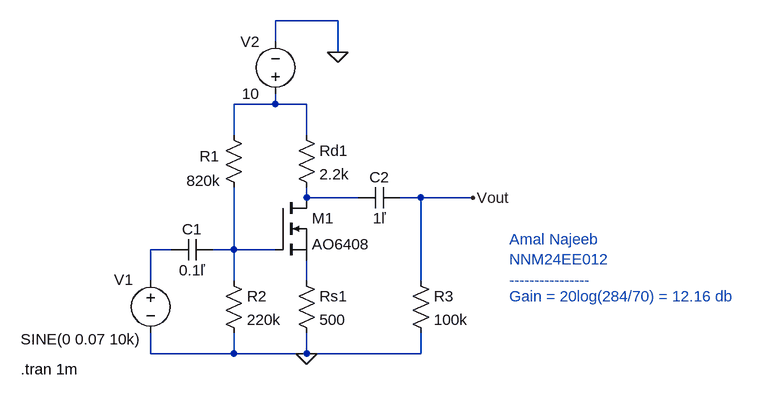
[diagram p0: schematic NNM24EE012_AmalNajeeb.asc]
NNM24EE012_AmalNajeeb.asc, the LTspice schematic file:
Version 4.1
SHEET 1 880 680
WIRE 192 -208 96 -208
WIRE 96 -176 96 -208
WIRE 192 -160 192 -208
WIRE 96 -80 96 -96
WIRE 96 -80 32 -80
WIRE 144 -80 96 -80
WIRE 32 -32 32 -80
WIRE 144 -32 144 -80
WIRE 144 64 144 48
WIRE 224 64 144 64
WIRE 320 64 288 64
WIRE 400 64 320 64
WIRE -64 144 -96 144
WIRE 32 144 32 48
WIRE 32 144 0 144
WIRE 96 144 32 144
WIRE -96 192 -96 144
WIRE 32 192 32 144
WIRE 144 192 144 160
WIRE 320 192 320 64
WIRE -96 304 -96 272
WIRE 32 304 32 272
WIRE 32 304 -96 304
WIRE 144 304 144 272
WIRE 144 304 32 304
WIRE 320 304 320 272
WIRE 320 304 144 304
FLAG 144 304 0
FLAG 192 -160 0
FLAG 400 64 Vout
SYMBOL nmos 96 64 R0
SYMATTR InstName M1
SYMATTR Value AO6408
SYMBOL res 16 -48 R0
WINDOW 0 -37 48 Left 2
WINDOW 3 -57 86 Left 2
SYMATTR InstName R1
SYMATTR Value 820k
SYMBOL res 16 176 R0
SYMATTR InstName R2
SYMATTR Value 220k
SYMBOL res 128 -48 R0
SYMATTR InstName Rd1
SYMATTR Value 2.2k
SYMBOL res 128 176 R0
SYMATTR InstName Rs1
SYMATTR Value 500
SYMBOL res 304 176 R0
SYMATTR InstName R3
SYMATTR Value 100k
SYMBOL cap 0 128 R90
WINDOW 0 0 32 VBottom 2
WINDOW 3 32 32 VTop 2
SYMATTR InstName C1
SYMATTR Value 0.1ľ
SYMBOL cap 224 80 R270
WINDOW 0 32 32 VTop 2
WINDOW 3 0 32 VBottom 2
SYMATTR InstName C2
SYMATTR Value 1ľ
SYMBOL voltage -96 176 R0
WINDOW 0 -56 14 Left 2
WINDOW 3 -200 106 Left 2
WINDOW 123 0 0 Left 0
WINDOW 39 0 0 Left 0
SYMATTR InstName V1
SYMATTR Value SINE(0 0.07 10k)
SYMBOL voltage 96 -80 R180
WINDOW 0 24 96 Left 2
WINDOW 3 24 16 Left 2
WINDOW 123 0 0 Left 0
WINDOW 39 0 0 Left 0
SYMATTR InstName V2
SYMATTR Value 10
TEXT -296 328 Left 2 !.tran 1m
TEXT 456 128 Left 2 ;Amal Najeeb\nNNM24EE012\n----------------
TEXT 456 216 Left 2 ;Gain = 20log(284/70) = 12.16 db

The netlist it stands for:
* NNM24EE012_AmalNajeeb.asc
M1 N002 N004 N005 N005 AO6408
R1 N001 N004 820k
R2 N004 0 220k
Rd1 N001 N002 2.2k
Rs1 N005 0 500
R3 Vout 0 100k
C1 N004 N003 0.1ľ
C2 N002 Vout 1ľ
V1 N003 0 SINE(0 0.07 10k)
V2 N001 0 10
.model NMOS NMOS
.model PMOS PMOS
.lib standard.mos
.tran 1m
* Amal Najeeb
* NNM24EE012
* ----------------
* Gain = 20log(284/70) = 12.16 db
.backanno
.end